# Altium project avcilar.PrjPcb
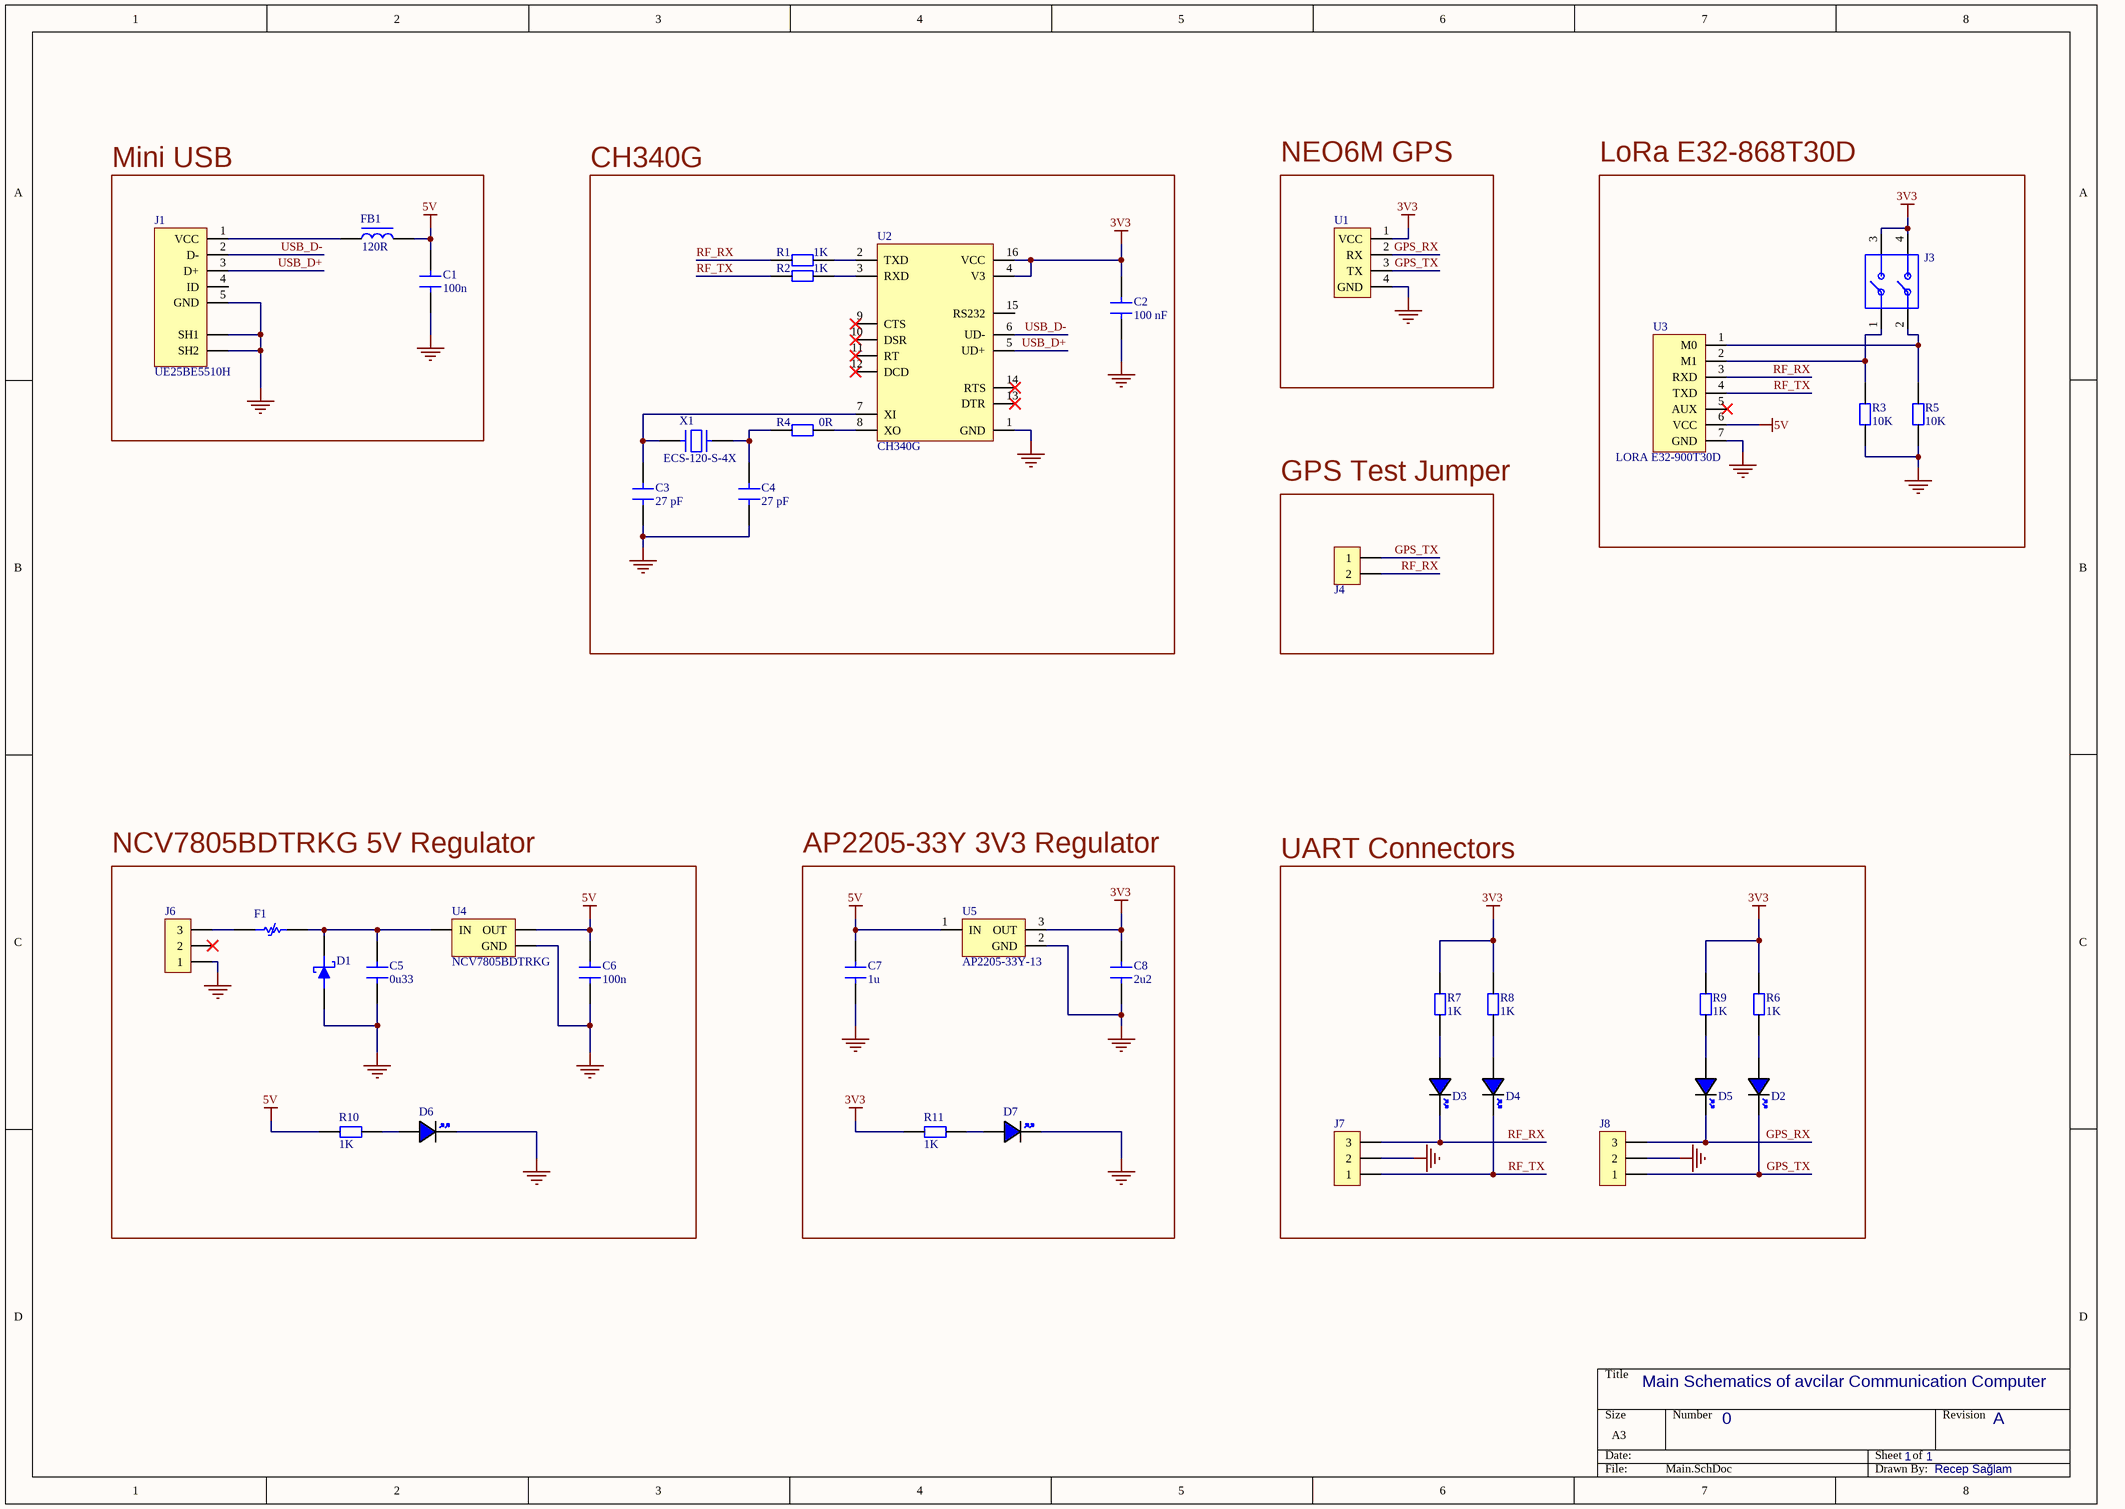
[diagram p0: Main.SchDoc]
1 sheet, 40 parts. Net scope: global (net labels, ports and power ports of the same name join across sheets).
Board file: avcilar.PcbDoc

## Sheet Main.SchDoc
size A3; SheetNumber: 1; SheetTotal: 1

### Parts
C1  100n  [CAP 0805]
C2  100 nF  [CAP 0805]
C3  27 pF  [CAP 0603]
C4  27 pF  [CAP 0603]
C5  0u33  [CAP 0805]
C6  100n  [CAP 0805]
C7  1u  [CAP 0805]
C8  2u2  [CAP 0805]
D1  SMBJ8.0CA-13-F  [SMBJ12CA-13-F]  (value not drawn)
D2  LED 0805 BLUE  [LED 0805 BLUE]  (value not drawn)
D3  LED 0805 BLUE  [LED 0805 BLUE]  (value not drawn)
D4  LED 0805 BLUE  [LED 0805 BLUE]  (value not drawn)
D5  LED 0805 BLUE  [LED 0805 BLUE]  (value not drawn)
D6  LED 0805 BLUE  [LED 0805 BLUE]  (value not drawn)
D7  LED 0805 BLUE  [LED 0805 BLUE]  (value not drawn)
F1  0ZCG0075FF2C  [0ZCG0075FF2C]  (value not drawn)
FB1  120R  [FB 0805]
J1  UE25BE5510H  [UE25BE55H]
J3  2 Pin DIP Switch  [2 PIN DIP SWITCH]  (value not drawn)
J4  1x2 HEADER MALE  [1x2 HEADER MALE]  (value not drawn)
J6  JST B3B-XH-A  [JST_B3B-XH-A]  (value not drawn)
J7  JST B3B-XH-A  [JST_B3B-XH-A]  (value not drawn)
J8  JST B3B-XH-A  [JST_B3B-XH-A]  (value not drawn)
R1  1K  [RES 0805]
R2  1K  [RES 0805]
R3  10K  [RES 0805]
R4  0R  [RES 0603]
R5  10K  [RES 0805]
R6  1K  [RES 0805]
R7  1K  [RES 0805]
R8  1K  [RES 0805]
R9  1K  [RES 0805]
R10  1K  [RES 0805]
R11  1K  [RES 0805]
U1  GPS GY-NEO6MV2  [GPS GY-NEO6MV2]  (value not drawn)
U2  CH340G  [CH340G]
U3  LORA E32-900T30D  [LORA E32-900T30D]
U4  NCV7805BDTRKG  [L78M05CDT-TR]
U5  AP2205-33Y-13  [AP2205-33Y-13]
X1  ECS-120-S-4X  [XTAL_ECS-120-S-4X]

### Blocks framed on the sheet
Mini USB: C1 FB1 J1
CH340G: C2-C4 R1 R2 R4 U2 X1
NEO6M GPS: U1
LoRa E32-868T30D: J3 R3 R5 U3
GPS Test Jumper: J4
NCV7805BDTRKG 5V Regulator: C5 C6 D1 D6 F1 J6 R10 U4
AP2205-33Y 3V3 Regulator: C7 C8 D7 R11 U5
UART Connectors: D2-D5 J7 J8 R6-R9

### Nets
3V3: C2.2 C8.2 J3.3 J3.4 R6.1 R7.1 R8.1 R9.1 R11.1 U1.1(VCC) U2.4(V3) U2.16(VCC) U5.3(OUT)
5V: C1.2 C6.2 C7.2 FB1.2 R10.1 U3.6(VCC) U4.3(OUT) U5.1(IN)
GND: C1.1 C2.1 C3.1 C4.1 C5.1 C6.1 C7.1 C8.1 D1.1 D6.K D7.K J1.5(GND) J1.SH1 J1.SH2 J6.1 J7.2 J8.2 R3.1 R5.1 U1.4(GND) U2.1(GND) U3.7(GND) U4.2(GND) U5.2(GND)
GPS_RX: D5.K J8.3 U1.2(RX)
GPS_TX: D2.K J4.1 J8.1 U1.3(TX)
RF_RX: D3.K J4.2 J7.3 R1.1 U3.3(RXD)
RF_TX: D4.K J7.1 R2.1 U3.4(TXD)
USB_D+: J1.3(D+) U2.5(UD+)
USB_D-: J1.2(D-) U2.6(UD-)
NetC3_2: C3.2 U2.7(XI) X1.1
NetC4_2: C4.2 R4.1 X1.2
NetC5_2: C5.2 D1.2 F1.2 U4.1(IN)
NetD2_A: D2.A R6.2
NetD3_A: D3.A R7.2
NetD4_A: D4.A R8.2
NetD5_A: D5.A R9.2
NetD6_A: D6.A R10.2
NetD7_A: D7.A R11.2
NetF1_1: F1.1 J6.3
NetFB1_1: FB1.1 J1.1(VCC)
NetJ3_1: J3.1 R3.2 U3.2(M1)
NetJ3_2: J3.2 R5.2 U3.1(M0)
NetR1_2: R1.2 U2.2(TXD)
NetR2_2: R2.2 U2.3(RXD)
NetR4_2: R4.2 U2.8(XO)

Not connected (* = marked no-connect by the designer): J1 4(ID); J6 2*; U2 9(CTS)* 10(DSR)* 11(RT)* 12(DCD)* 13(DTR)* 14(RTS)* 15(RS232); U3 5(AUX)*

### Notes on the sheet
- Main Schematics of avcilar Communication Computer
- 0
- 1
- A
- Recep Sağlam

### Library data of the parts
C1 C2 C5-C8 = CAP 0805 50V: Capacitor SMD 0805 50V
C3 C4 = CAP 0603 50V: Capacitor SMD 0603 50V
D1 = SMBJ8.0CA-13-F: SMBJ Series 8 V 600 W SMT Bi-Directional Transient Voltage Suppressor - SMB; Manufacturer: Diodes Zetex; Supplier 1: Future Electronics; Manufacturer Part Number: SMBJ8.0CA-13-F; RoHS: Yes; Category: TVS Diodes; Stock 1: 6000; Pricing 1: 3000=0,107, 9000=0,103, 12000=0,102, 30000=0,0982, 45000=0,095 (USD); ComponentLink1URL: https://datasheet.ciiva.com/16393/ds19002-16393013.pdf?src-supplier=Future+Electronics; ComponentLink1Description: https://datasheet.ciiva.com/16393/ds19002-16393013.pdf?src-supplier=Future+Electronics; Supplier Part Number 1: 9153168
D2-D7 = LED 0805 BLUE: LED 0805 GREEN SMD
F1 = 0ZCG0075FF2C: PTC Resettable Fuse 0.75A(hold) 1.5A(trip) 16VDC 100A 0.8W 0.2s 0.11Ohm SMD Solder Pad 1812 4.73 X 3.41 X 0.65mm T/R...; Manufacturer: Bel; Hold Current: 750mA; Time to Trip: 200ms; Supplier 1: Arrow Electronics; Manufacturer Part Number: 0ZCG0075FF2C; RoHS: Yes; Category: PTC Resettable Fuses; Stock 1: 4661; Pricing 1: 2000=0,0751, 4000=0,0699, 6000=0,065, 10000=0,0604 (USD); Mount: Surface Mount; Case/Package: 1812; Case Code (Metric): 4532; Case Code (Imperial): 1812; Contact Plating: Tin,Matte; Min Operating Temperature: -40°C; Max Operating Temperature: 85°C; Packaging: Cut Tape; Max Current Rating: 100A; Trip Current: 1.5A; Series: 0ZCG; Lead Free: Lead Free; RoHS Compliant: Yes; ComponentLink1URL: https://datasheet.ciiva.com/18550/0zcg-18550523.pdf?src-supplier=Digi-Key; ComponentLink1Description: https://datasheet.ciiva.com/18550/0zcg-18550523.pdf?src-supplier=Digi-Key; ComponentLink2URL: https://datasheet.ciiva.com/18550/0zcg-18550524.pdf?src-supplier=Digi-Key; ComponentLink2Description: https://datasheet.ciiva.com/18550/0zcg-18550524.pdf?src-supplier=Digi-Key; ComponentLink3URL: https://datasheet.ciiva.com/18550/0zcg-18550767.pdf?src-supplier=Digi-Key; ComponentLink3Description: https://datasheet.ciiva.com/18550/0zcg-18550767.pdf?src-supplier=Digi-Key
FB1 = FB 0805: Ferrite Bead SMD 0805
J1 = UE25BE5510H: Conn Mini USB 2.0 Type B RCP 5 POS 0.8mm Solder ST Thru-Hole 5 Terminal 1 Port; Manufacturer: Amphenol Commercial; Supplier 1: Arrow Electronics; Manufacturer Part Number: UE25BE5510H; RoHS: Yes; Category: USB Connectors; Stock 1: 16852; Pricing 1: 1=0,4693, 10=0,4507, 25=0,4468, 50=0,4303, 100=0,4157 (USD); ComponentLink1URL: http://www.alliedelec.com/m/d/e7e3d7a920045eebbdef787e60d8b001.pdf?src-supplier=Allied+Electronics; ComponentLink1Description: http://www.alliedelec.com/m/d/e7e3d7a920045eebbdef787e60d8b001.pdf?src-supplier=Allied+Electronics; ComponentLink2URL: https://www.amphenolcanada.com/ProductSearch/drawings/AC/UE25BEX510X.pdf?src-supplier=Digi-Key; ComponentLink2Description: https://www.amphenolcanada.com/ProductSearch/drawings/AC/UE25BEX510X.pdf?src-supplier=Digi-Key; ComponentLink3URL: https://datasheet.octopart.com/UE25-BE55-10H-Amphenol-datasheet-14681365.pdf?src-supplier=Future+Electronics; ComponentLink3Description: https://datasheet.octopart.com/UE25-BE55-10H-Amphenol-datasheet-14681365.pdf?src-supplier=Future+Electronics; ComponentLink4URL: https://datasheet.octopart.com/UE25BE5510H-Amphenol-Communications-Solutions-datasheet-62282189.pdf?src-supplier=Electro+Sonic; ComponentLink4Description: https://datasheet.octopart.com/UE25BE5510H-Amphenol-Communications-Solutions-datasheet-62282189.pdf?src-supplier=Electro+Sonic; Supplier Part Number 1: UE25BE5510H
J6-J8 = JST B3B-XH-A: Connector Header, XH Series, 3 Position, 2.50mm, Through Hole, Press-Fit, Solder, Natural; Manufacturer Part Number: B3B-XH-A(LF)(SN); Supplier 1: CoreStaff; Manufacturer: JST; RoHS: Yes; Category: Headers and Wire Housings; Stock 1: 2101; Pricing 1: 1=39,94, 10=25,1, 50=21,68, 100=18,25, 500=17,57, 1000=17,12, 2000=16,44, 4000=15,79 (JPY); ComponentLink1URL: https://datasheet.ciiva.com/26894/getdatasheetpartid-640434-26894454.pdf?src-supplier=Verical; ComponentLink1Description: https://datasheet.ciiva.com/26894/getdatasheetpartid-640434-26894454.pdf?src-supplier=Verical; ComponentLink2URL: https://datasheet.ciiva.com/26894/getdatasheetpartid-440399-26894778.pdf?src-supplier=Verical; ComponentLink2Description: https://datasheet.ciiva.com/26894/getdatasheetpartid-440399-26894778.pdf?src-supplier=Verical; ComponentLink3URL: https://datasheet.ciiva.com/11746/0900766b8082653f-11746520.pdf?src-supplier=Rs; ComponentLink3Description: https://datasheet.ciiva.com/11746/0900766b8082653f-11746520.pdf?src-supplier=Rs
R1-R3 R5-R11 = RES 0805: Resistor SMD 0805
R4 = RES 0603: Resistor SMD 0603
U1 = GPS GY-NEO6MV2: GY-NEO6MV2 GPS Module
U2 = CH340G: USB Interface Integrated Circuit
U3 = LORA E32-900T30D: SX1276 E32-868T30D LoRa Module
U4 = L78M05CDT-TR: IC REG LDO 5V 0.5A DPAK; Manufacturer: STMicroelectronics; Number of Outputs: 1; Max Input Voltage: 35V; Max Output Current: 500mA; Polarity: Positive; Quiescent Current: 6mA; Output Type: Fixed; Min Input Voltage: 7V; Dropout Voltage: 2V; Tolerance: 5%; Power Supply Rejection Ratio (PSRR): 62dB; Supplier 1: Mouser; Manufacturer Part Number: L78M05CDT-TR; RoHS: Yes; Category: Voltage Regulators - Linear; Stock 1: 74380; Pricing 1: 1=0,72, 10=0,629, 50=0,629, 100=0,482, 1000=0,305, 10000=0,277 (USD); Mount: Surface Mount; Case/Package: TO-252; Number of Pins: 3; Min Operating Temperature: 0°C; Max Operating Temperature: 150°C; Output Voltage: 5V; Packaging: Tape and Reel; Package Quantity: 2500; Output Current: 500mA; Nominal Output Voltage: 5V; Number of Regulators: 1; Min Output Voltage: 5V; Max Output Voltage: 5V; Series: -; Output Configuration: Positive; Length: 6.6mm; Width: 6.2mm; Height: 2.4mm; Radiation Hardening: No; RoHS Compliant: Yes; Reach SVHC Compliant: No; Lead Free: Lead Free; ComponentLink1URL: https://datasheet.ciiva.com/34303/2021024-34303902.pdf?src-supplier=Jameco; ComponentLink1Description: https://datasheet.ciiva.com/34303/2021024-34303902.pdf?src-supplier=Jameco; ComponentLink2URL: https://datasheet.ciiva.com/4882/cd00000447-93067-4882369.pdf?src-supplier=Mouser; ComponentLink2Description: https://datasheet.ciiva.com/4882/cd00000447-93067-4882369.pdf?src-supplier=Mouser; ComponentLink3URL: https://datasheet.ciiva.com/15111/getdatasheetpartid-111001-15111751.pdf?src-supplier=Verical; ComponentLink3Description: https://datasheet.ciiva.com/15111/getdatasheetpartid-111001-15111751.pdf?src-supplier=Verical; ComponentLink4URL: https://datasheet.ciiva.com/1512/1834365-1512349.pdf?src-supplier=Element14; ComponentLink4Description: https://datasheet.ciiva.com/1512/1834365-1512349.pdf?src-supplier=Element14; ComponentLink5URL: https://datasheet.ciiva.com/14111/tbl78mxxc-data-e-14111354.pdf?src-supplier=Distrelec; ComponentLink5Description: https://datasheet.ciiva.com/14111/tbl78mxxc-data-e-14111354.pdf?src-supplier=Distrelec; ComponentLink6URL: https://datasheet.ciiva.com/46425/1834365-46425535.pdf?src-supplier=Element14; ComponentLink6Description: https://datasheet.ciiva.com/46425/1834365-46425535.pdf?src-supplier=Element14; ComponentLink7URL: https://datasheet.ciiva.com/2041/cd00000447-2041991.pdf?src-supplier=Digi-Key; ComponentLink7Description: https://datasheet.ciiva.com/2041/cd00000447-2041991.pdf?src-supplier=Digi-Key; ComponentLink8URL: https://datasheet.ciiva.com/2041/cd00000447-2041990.pdf?src-supplier=Digi-Key; ComponentLink8Description: https://datasheet.ciiva.com/2041/cd00000447-2041990.pdf?src-supplier=Digi-Key; ComponentLink9URL: https://datasheet.ciiva.com/2041/cd00000447-2041992.pdf?src-supplier=Digi-Key; ComponentLink9Description: https://datasheet.ciiva.com/2041/cd00000447-2041992.pdf?src-supplier=Digi-Key; ComponentLink10URL: https://datasheet.ciiva.com/16443/cd00000447-16443381.pdf?src-supplier=Future+Electronics; ComponentLink10Description: https://datasheet.ciiva.com/16443/cd00000447-16443381.pdf?src-supplier=Future+Electronics; ComponentLink11URL: https://datasheet.ciiva.com/41439/001184659-da-01-en-ic-reg-ldo-5v-l78m05cdt-tr-to-252-3-stm-41439772.pdf?src-supplier=Conrad; ComponentLink11Description: https://datasheet.ciiva.com/41439/001184659-da-01-en-ic-reg-ldo-5v-l78m05cdt-tr-to-252-3-stm-41439772.pdf?src-supplier=Conrad
U5 = AP2205-33Y-13: Ldo, Fixed, 3.3V, 0.2A, Sot-89-3 Rohs Compliant: Yes |Diodes Inc. AP2205-33Y-13; Manufacturer: Diodes; Output Configuration: Positive; Number of Regulators: 1; Max Input Voltage: 24V; Output Current: 250mA; Power Supply Rejection Ratio (PSRR): 60dB; Supplier 1: Digi-Key; Manufacturer Part Number: AP2205-33Y-13; RoHS: Yes; Stock 1: 104598; Pricing 1: 1=0,46, 10=0,372, 25=0,34, 100=0,2531, 250=0,22936, 500=0,1898, 1000=0,14235 (USD); Mount: Surface Mount; Case/Package: TO-243AA; Min Operating Temperature: -40°C; Max Operating Temperature: 125°C; Output Type: Fixed; Series: -; Packaging: Cut Tape; Min Output Voltage: 3.3V; ComponentLink1URL: https://datasheet.octopart.com/AP2205-33Y-13-Diodes-Inc.-datasheet-149521333.pdf?src-supplier=Farnell; ComponentLink1Description: https://datasheet.octopart.com/AP2205-33Y-13-Diodes-Inc.-datasheet-149521333.pdf?src-supplier=Farnell; ComponentLink2URL: https://www.diodes.com/assets/Datasheets/AP2205.pdf?src-supplier=Digi-Key; ComponentLink2Description: https://www.diodes.com/assets/Datasheets/AP2205.pdf?src-supplier=Digi-Key; ComponentLink3URL: https://datasheet.octopart.com/AP2205-33Y-13-Diodes-Inc.-datasheet-145012309.pdf?src-supplier=SHENGYU+ELECTRONICS; ComponentLink3Description: https://datasheet.octopart.com/AP2205-33Y-13-Diodes-Inc.-datasheet-145012309.pdf?src-supplier=SHENGYU+ELECTRONICS; Supplier Part Number 1: AP2205-33Y-13DICT-ND
X1 = ECS-120-S-4X: Crystal 12MHz ±30ppm (Tol) ±50ppm (Stability) Series FUND 60Ohm 2-Pin HC-49/USX Thru-Hole Bulk; Manufacturer: ECS International; ESR (Equivalent Series Resistance): 60R; Supplier 1: Arrow Electronics; Manufacturer Part Number: ECS-120-S-4X; RoHS: Yes; Category: Crystals; Stock 1: 2209; Pricing 1: 1=0,4681, 10=0,407, 50=0,4025, 100=0,3735, 500=0,3613, 1000=0,3221, 2500=0,3087 (USD); Mount: Through Hole; Number of Pins: 49; Min Operating Temperature: -10°C; Max Operating Temperature: 70°C; Frequency: 12MHz; Package Quantity: 200; Tolerance: 30ppm; Packaging: Bulk; Frequency Tolerance: 30ppm; Frequency Stability: 50ppm; Termination: Radial; Series: HC-49USX; Length: 11.35mm; Width: 4.65mm; Height: 3.5mm; Lead Free: Lead Free; ComponentLink1URL: https://datasheet.ciiva.com/853/hc-49usx-853380.pdf?src-supplier=Digi-Key; ComponentLink1Description: https://datasheet.ciiva.com/853/hc-49usx-853380.pdf?src-supplier=Digi-Key